# Altium schematic sheet Bluetooth.SchDoc
size Letter
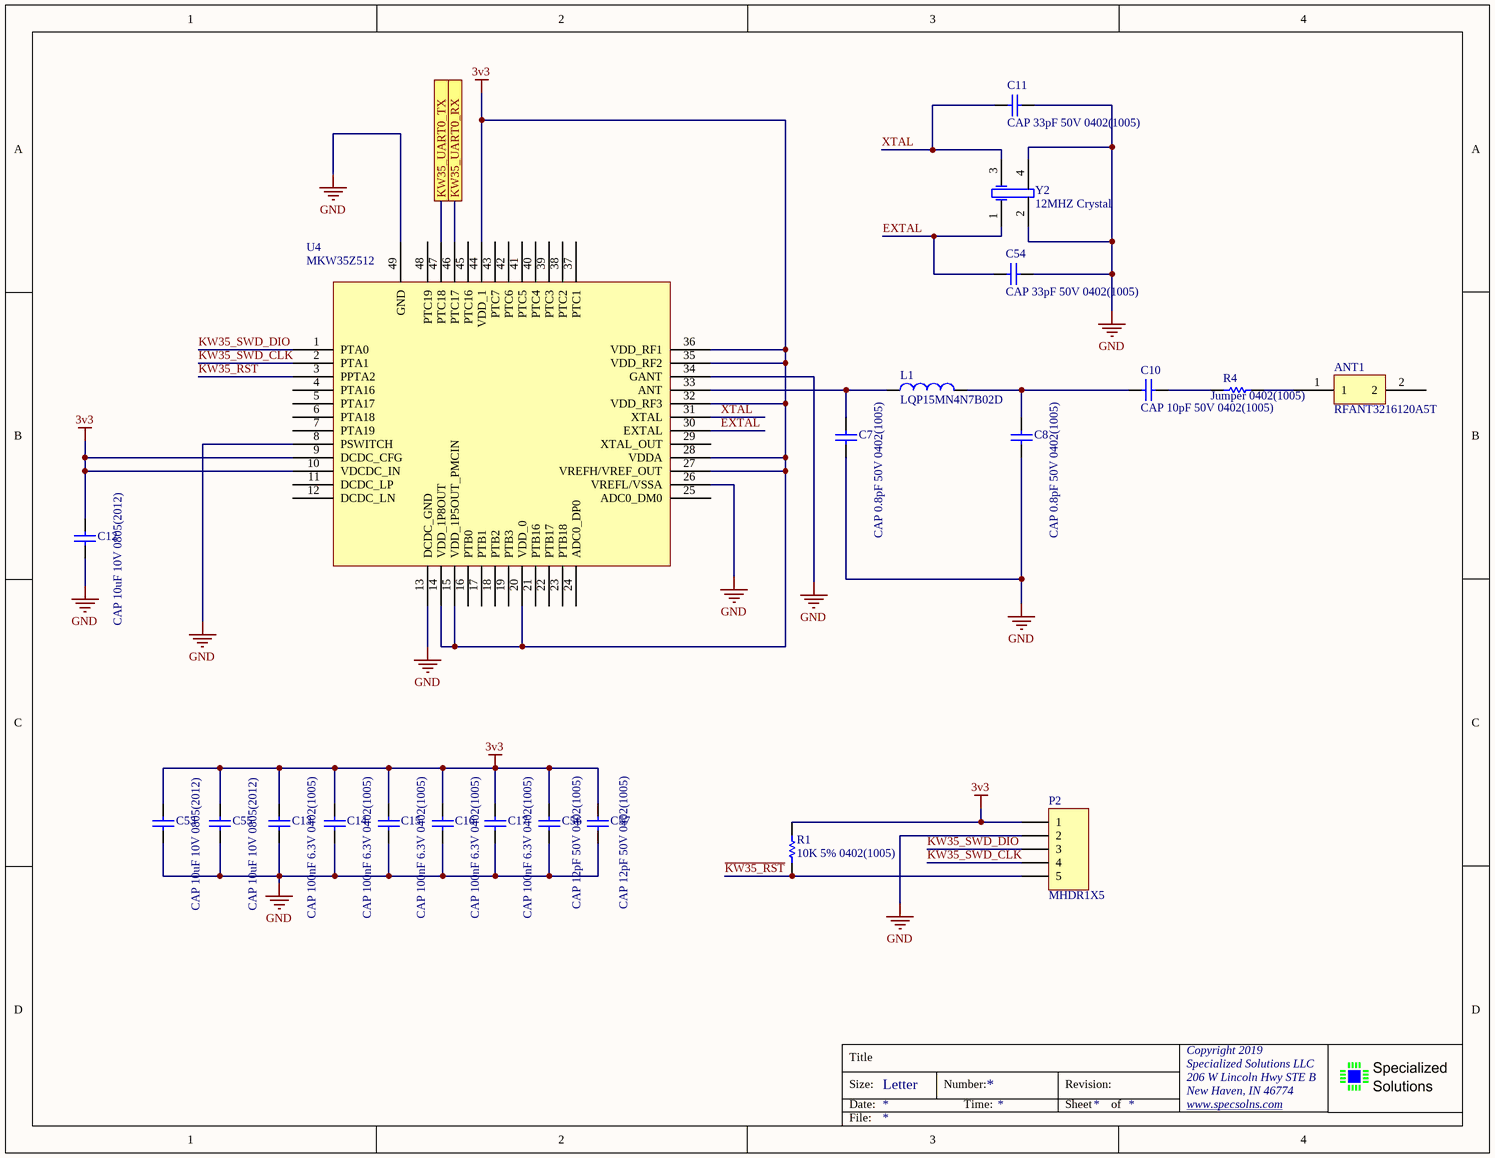
[diagram p0: Bluetooth.SchDoc]

## Parts
ANT1  RFANT3216120A5T  [RFANT3216120A5T]
C7  CAP 0.8pF 50V 0402(1005)  [CAPC0402(1005)60_N]
C8  CAP 0.8pF 50V 0402(1005)  [CAPC0402(1005)60_N]
C10  CAP 10pF 50V 0402(1005)  [CAPC0402(1005)60_L]
C11  CAP 33pF 50V 0402(1005)  [CAPC0402(1005)60_N]
C12  CAP 10uF 10V 0805(2012)  [CAPC0805(2012)145_N]
C13  CAP 100nF 6.3V 0402(1005)  [CAPC0402(1005)60_M]
C14  CAP 100nF 6.3V 0402(1005)  [CAPC0402(1005)60_M]
C15  CAP 100nF 6.3V 0402(1005)  [CAPC0402(1005)60_M]
C16  CAP 100nF 6.3V 0402(1005)  [CAPC0402(1005)60_M]
C17  CAP 100nF 6.3V 0402(1005)  [CAPC0402(1005)60_M]
C53  CAP 10uF 10V 0805(2012)  [CAPC0805(2012)145_N]
C54  CAP 33pF 50V 0402(1005)  [CAPC0402(1005)60_N]
C55  CAP 10uF 10V 0805(2012)  [CAPC0805(2012)145_N]
C56  CAP 12pF 50V 0402(1005)  [CAPC0402(1005)33_L]
C57  CAP 12pF 50V 0402(1005)  [CAPC0402(1005)33_L]
L1  LQP15MN4N7B02D  [INDC1005X45X25LL10T10]
P2  MHDR1X5  [MHDR1X5]
R1  10K 5% 0402(1005)  [RESC0402(1005)_N]
R4  Jumper 0402(1005)  [RESC0402(1005)_N]
U4  MKW35Z512  [VQFN64R]
Y2  12MHZ Crystal  [DFN155P250X80-4N]

## Ports
KW35_UART0_RX, KW35_UART0_TX

## Nets
3v3: C12.1 C13.2 C14.2 C15.2 C16.2 C17.2 C53.1 C55.1 C56.2 C57.2 P2.1 R1.2 U4.9(DCDC_CFG) U4.10(VDCDC_IN) U4.14(VDD_1P8OUT) U4.15(VDD_1P5OUT_PMCIN) U4.20(VDD_0) U4.27(VREFH/VREF_OUT) U4.28(VDDA) U4.32(VDD_RF3) U4.35(VDD_RF2) U4.36(VDD_RF1) U4.44(VDD_1)
GND: C7.1 C8.1 C11.2 C12.2 C13.1 C14.1 C15.1 C16.1 C17.1 C53.2 C54.2 C55.2 C56.1 C57.1 P2.2 U4.8(PSWITCH) U4.13(DCDC_GND) U4.26(VREFL/VSSA) U4.34(GANT) U4.49(GND) Y2.2(GND) Y2.4(GND)
~{KW35_RST}: P2.5 R1.1 U4.3(PPTA2)
EXTAL: C54.1 U4.30(EXTAL) Y2.1(OSC1)
KW35_SWD_CLK: P2.4 U4.2(PTA1)
KW35_SWD_DIO: P2.3 U4.1(PTA0)
KW35_UART0_RX: U4.46(PTC17) ; port KW35_UART0_RX
KW35_UART0_TX: U4.47(PTC18) ; port KW35_UART0_TX
XTAL: C11.1 U4.31(XTAL) Y2.3(OSC2)
NetANT1_1: ANT1.1 R4.2
NetC7_2: C7.2 L1.1 U4.33(ANT)
NetC8_2: C8.2 C10.1 L1.2
NetC10_2: C10.2 R4.1

Not connected (* = marked no-connect by the designer): ANT1 2; U4 4(PTA16) 5(PTA17) 6(PTA18) 7(PTA19) 11(DCDC_LP) 12(DCDC_LN) 16(PTB0) 17(PTB1) 18(PTB2) 19(PTB3) 21(PTB16) 22(PTB17) 23(PTB18) 24(ADC0_DP0) 25(ADC0_DM0) 29(XTAL_OUT) 37(PTC1) 38(PTC2) 39(PTC3) 40(PTC4) 41(PTC5) 42(PTC6) 43(PTC7) 45(PTC16) 48(PTC19)

## Notes on the sheet
- Title
- Size:
- Date:
- Letter
- Number:
- Time:
- Revision:
- Sheet
- of
- Copyright 2019
- Specialized Solutions LLC
- 206 W Lincoln Hwy STE B
- New Haven, IN 46774
- www.specsolns.com <http://www.specsolns.com>
- File:

## Library data of the parts
ANT1 = RFANT3216120A5T: RF ANT 2.4GHZ CHIP SOLDER SMD
C7 C8 = CMP-1034-00043-1: CAP 0.8pF 50V ±0.1pF 0402 (1005 Metric) Thickness 0.6mm SMD; Case-EIA: 0402; Case-Metric: 1005; Tolerance: Â±0.1pF; Max Thickness: 0.6 mm; Technology: SMT; Value: 0.8pF; Rated Voltage: 50 V
C10 = CMP-1034-00722-1: CAP 10pF 50V ±2% 0402 (1005 Metric) Thickness 0.6mm SMD; Tolerance: Â±2%; Case-Metric: 1005; Case-EIA: 0402; Technology: SMT; Value: 10pF; Max Thickness: 0.6 mm; Rated Voltage: 50 V
C11 C54 = CMP-1034-01004-1: CAP 33pF 50V ±5% 0402 (1005 Metric) Thickness 0.6mm SMD; Tolerance: Â±5%; Case-Metric: 1005; Case-EIA: 0402; Rated Voltage: 50 V; Value: 33pF; Technology: SMT; Max Thickness: 0.6 mm
C12 C53 C55 = CMP-1036-04924-1: CAP 10uF 10V ±20% 0805 (2012 Metric) Thickness 1.45mm SMD; Case-EIA: 0805; Case-Metric: 2012; Tolerance: Â±20%; Rated Voltage: 10 V; Max Thickness: 1.45 mm; Value: 10uF; Technology: SMT
C13-C17 = CMP-1034-02062-1: CAP 100nF 6.3V ±20% 0402 (1005 Metric) Thickness 0.6mm SMD; Case-EIA: 0402; Tolerance: Â±20%; Case-Metric: 1005; Value: 100nF; Technology: SMT; Max Thickness: 0.6 mm; Rated Voltage: 6.3 V
C56 C57 = CMP-1034-00769-1: CAP 12pF 50V ±5% 0402 (1005 Metric) Thickness 0.33mm SMD; Tolerance: Â±5%; Case-EIA: 0402; Case-Metric: 1005; Rated Voltage: 50 V; Max Thickness: 0.33 mm; Value: 12pF; Technology: SMT
L1 = CMP-2000-06592-1: Chip Inductor, 4.7 nH, +/- 0.1 nH, 160 mA, -40 to 85 degC, 0402 (1005 Metric), RoHS, Tape and Reel; Manufacturer: Murata; Maximum DC Resistance: 600mOhm; Type: RFChip; Inductance: 4.7nH; Product Height: 0.45mm; Maximum DC Current: 160mA; Minimum Quality Factor: 13@500MHz; Rad Hard: No; Tolerance: 0.1nH; Product Depth: 0.6mm; Package Description: 2-Pin Surface Mount Device, Body 1 x 0.5 mm; Package Reference: 0402; Datasheet Version: 09/2010; Packaging: Tape&Reel; Manufacturer URL: http://www.murata.com/; Package/Case: 0402; Datasheet URL: http://search.murata.co.jp/Ceramy/image/img/PDF/ENG/L0075S0084LQP15M.pdf; Mounting Technology: SurfaceMount
P2 = MHDR1X5: Header, 5-Pin; LatestRevisionDate: 17-Jul-2002; LatestRevisionNote: Re-released for DXP Platform.; Publisher: Altium Limited
R1 = CMP-1011-00098-1: 10K 0.063W 5% 0402 (1005 Metric)  SMD; Case-Metric: 1005; Value: 10000.00 Ohm; Case-EIA: 0402; Technology: SMT; Tolerance: 5 %; Power: 0.063 W
R4 = CMP-1011-00001-1: Jumper 0402 (1005 Metric); Tolerance: None; Case-Metric: 1005; Case-EIA: 0402; Value: 0.00 Ohm; Power: None; Technology: SMT
U4 = MKW36Z512: KINETIS W 32-BIT MCU ARM CORTEX- Bluetooth
Y2 = 403C11E16M00000: CRYSTAL 12.0000MHZ 20PF SMD 3.20x2.50; Published: 8-Jun-2000; LatestRevisionDate: 17-Jul-2002; LatestRevisionNote: Re-released for DXP Platform.; PackageReference: R38; Publisher: Altium Limited; PackageDescription: Crystal, Thru-Hole; 2 Leads; Body 3.1 x 8.2 mm (Dia.xH)